# Altium schematic sheet Sheet4.SchDoc
size A4
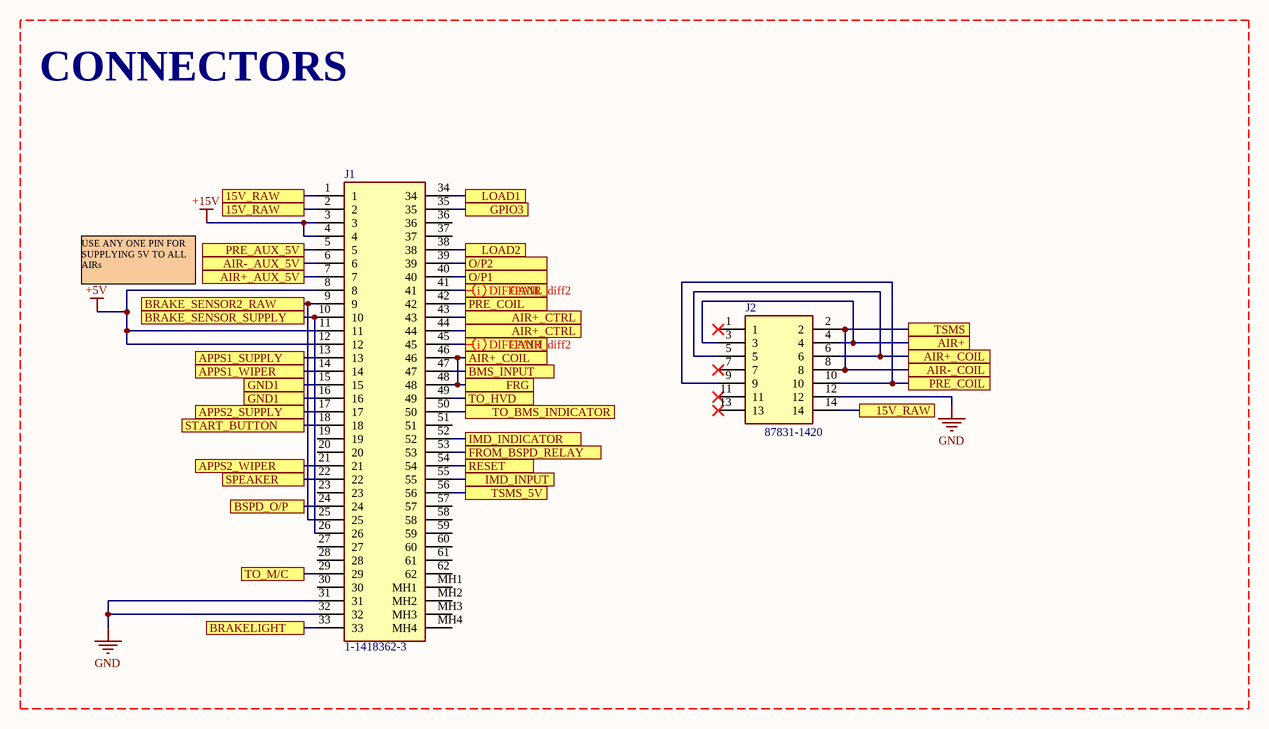
[diagram p0: Sheet4.SchDoc]

## Parts
J1  1-1418362-3  [114183623]
J2  87831-1420  [SHDR14W55P200_2X7_1665X630X640P]

## Blocks framed on the sheet
CONNECTORS: J1 J2

## Ports
15V_RAW, AIR+, AIR+_AUX_5V, AIR+_COIL, AIR+_CTRL, AIR-_AUX_5V, AIR-_COIL, APPS1_SUPPLY, APPS1_WIPER, APPS2_SUPPLY, APPS2_WIPER, BMS_INPUT, BRAKE_SENSOR2_RAW, BRAKE_SENSOR_SUPPLY, BRAKELIGHT, BSPD_O/P, CANH, CANL, FRG, FROM_BSPD_RELAY, GND1, GPIO3, IMD_INDICATOR, IMD_INPUT, LOAD1, LOAD2, O/P1, O/P2, PRE_AUX_5V, PRE_COIL, RESET, SPEAKER, START_BUTTON, TO_BMS_INDICATOR, TO_HVD, TO_M/C, TSMS, TSMS_5V

## Nets
+5V: J1.8 J1.11 J1.12
+15V: J1.3 J1.4
GND: J1.31 J1.32 J2.12
15V_RAW: J1.1 J1.2 J2.14 ; port 15V_RAW
AIR+: J2.3 J2.4 ; port AIR+
AIR+_AUX_5V: J1.7 ; port AIR+_AUX_5V
AIR+_COIL: J1.46 J1.48 J2.5 J2.6 ; port AIR+_COIL, port FRG
AIR+_CTRL: J1.43 J1.44 ; port AIR+_CTRL
AIR-_AUX_5V: J1.6 ; port AIR-_AUX_5V
AIR-_COIL: J2.2 J2.8 ; port AIR-_COIL, port TSMS
APPS1_SUPPLY: J1.13 ; port APPS1_SUPPLY
APPS1_WIPER: J1.14 ; port APPS1_WIPER
APPS2_SUPPLY: J1.17 ; port APPS2_SUPPLY
APPS2_WIPER: J1.21 ; port APPS2_WIPER
BMS_INPUT: J1.47 ; port BMS_INPUT
BRAKE_SENSOR2_RAW: J1.9 J1.25 ; port BRAKE_SENSOR2_RAW
BRAKE_SENSOR_SUPPLY: J1.10 J1.26 ; port BRAKE_SENSOR_SUPPLY
BRAKELIGHT: J1.33 ; port BRAKELIGHT
BSPD_O/P: J1.24 ; port BSPD_O/P
CANH: J1.45 ; port CANH
CANL: J1.41 ; port CANL
FROM_BSPD_RELAY: J1.53 ; port FROM_BSPD_RELAY
GND1: J1.15 J1.16 ; port GND1
GPIO3: J1.35 ; port GPIO3
IMD_INDICATOR: J1.52 ; port IMD_INDICATOR
IMD_INPUT: J1.55 ; port IMD_INPUT
LOAD1: J1.34 ; port LOAD1
LOAD2: J1.38 ; port LOAD2
O/P1: J1.40 ; port O/P1
O/P2: J1.39 ; port O/P2
PRE_AUX_5V: J1.5 ; port PRE_AUX_5V
PRE_COIL: J1.42 J2.9 J2.10 ; port PRE_COIL
RESET: J1.54 ; port RESET
SPEAKER: J1.22 ; port SPEAKER
START_BUTTON: J1.18 ; port START_BUTTON
TO_BMS_INDICATOR: J1.50 ; port TO_BMS_INDICATOR
TO_HVD: J1.49 ; port TO_HVD
TO_M/C: J1.29 ; port TO_M/C
TSMS_5V: J1.56 ; port TSMS_5V

Not connected (* = marked no-connect by the designer): J1 19 20 23 27 28 30 36 37 51 57 58 59 60 61 62 MH1 MH2 MH3 MH4; J2 1* 7* 11* 13*

## Layout directives
differential pair; differential pair class *: CANH, CANL

## Notes on the sheet
- USE ANY ONE PIN FOR SUPPLYING 5V TO ALL AIRs

## Library data of the parts
J1 = 1-1418362-3: Connector; Manufacturer_Name: TE Connectivity; Datasheet Link: https://www.arrow.com/en/products/1-1418362-3/te-connectivity; Height: 48mm; Manufacturer_Part_Number: 1-1418362-3; Mouser Part Number: 571-1-1418362-3; Mouser Price/Stock: https://www.mouser.co.uk/ProductDetail/TE-Connectivity-AMP/1-1418362-3?qs=J7fCQMU5Gej7aVw8AejcvQ%3D%3D; Arrow Part Number: 1-1418362-3; Arrow Price/Stock: https://www.arrow.com/en/products/1-1418362-3/te-connectivity
J2 = 87831-1420: Connector; Manufacturer_Name: Molex; Datasheet Link: http://docs-emea.rs-online.com/webdocs/150d/0900766b8150deae.pdf; Height: 6.4mm; Manufacturer_Part_Number: 87831-1420; Mouser Part Number: 538-87831-1420; Mouser Price/Stock: https://www.mouser.co.uk/ProductDetail/Molex/87831-1420/?qs=QtQX4uD3c2VDCL534TqpVg%3D%3D